# Altium schematic sheet Sheet3.SchDoc: =GlobalProjectName
size 209 x 297 mm; ApprovedBy: Утвердил; CheckedBy: Проверил; Author: Разработал; SheetNumber: 52; SheetTotal: 66; PageSetup: Record=PageOptions|CenterHorizontal=True|CenterVertical=True|PrintScale=1.00|XCorrection=1.00|YCorrection=1.00|PrintKind=1|BorderSize=5000000|LeftOffset=0|BottomOffset=0|Orientation=2|PaperLength=1000|PaperWidth=1000|Scale=100|PaperSource=15|PrintQuality=1200|MediaType=1|DitherType=10|PaperKind=A3|PrintScaleMode=1; Weight: -; ScaleFactor: -; NormInspection: Норм.Контр.
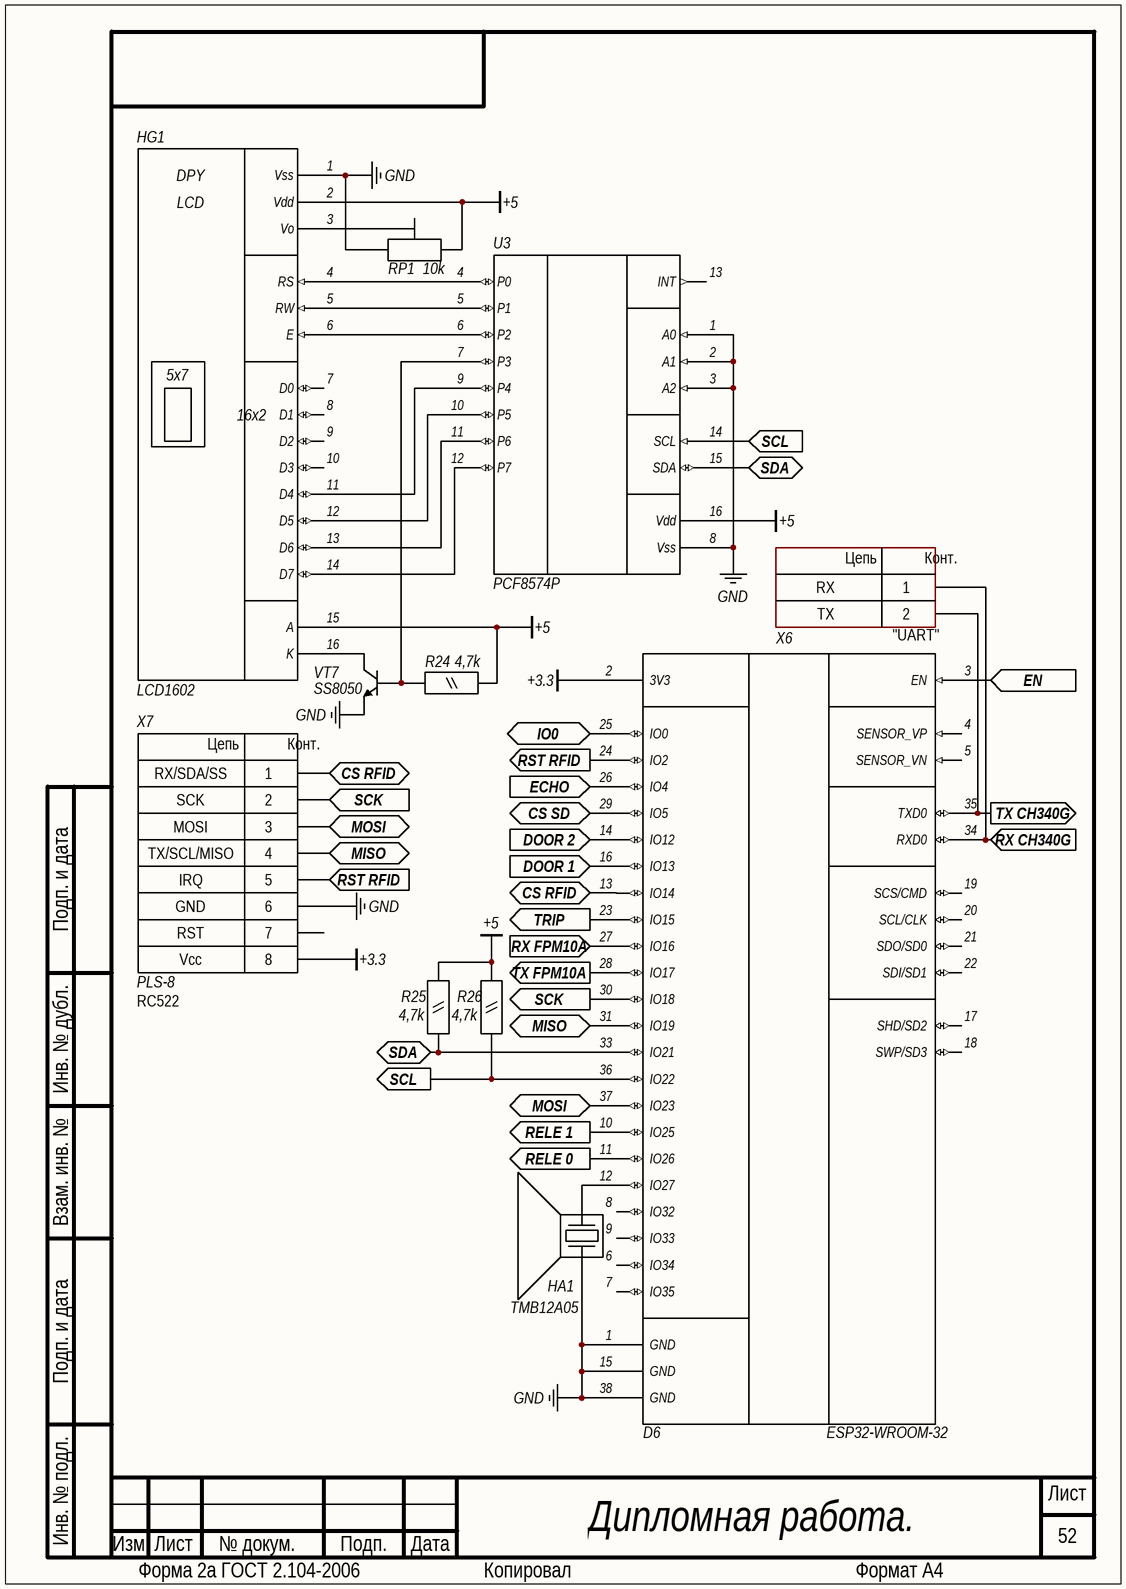
[diagram p0: Sheet3.SchDoc]

## Parts
D6  ESP32-WROOM-32  [D ESP-WROOOM-32]
HA1  TMB12A05  [HA TMB12A05]
HG1  LCD1602  [X PBS-16]
R24  4,7k  [R SMD 0805]
R25  4,7k  [R SMD 0805]
R26  4,7k  [R SMD 0805]
RP1  10k  [R ADJ-3296W]
U3  PCF8574P  [U DIP-16]
VT7  SS8050  [U SOT-23-3]
X6  CommentText: "UART"  Text1: RX  Text2: TX  [CON: PLS-2]
X7  PLS-8  CommentText: RC522  [X PLS-8]

## Ports
CS RFID (bidir), CS SD (bidir), DOOR 1 (in), DOOR 2 (in), ECHO (in), EN (in), IO0 (bidir), MISO (bidir), MOSI (bidir), RELE 0 (out), RELE 1 (out), RST RFID (in), RST RFID (out), RX CH340G (in), RX FPM10A (in), SCK (in), SCK (out), SCL (in), SCL (out), SDA (bidir), TRIP (out), TX CH340G (out), TX FPM10A (out)

## Nets
+3.3: D6.2(3V3) X7.8
+5: HG1.2(Vdd) HG1.15(A) R24.1 R25.1 R26.1 RP1.1 U3.16(Vdd)
GND: D6.1(GND) D6.15(GND) D6.38(GND) HA1.2(-) HG1.1(Vss) RP1.3 U3.1(A0) U3.2(A1) U3.3(A2) U3.8(Vss) VT7.1(E) X7.6
CS RFID: D6.13(IO14) X7.1 ; port CS RFID
CS SD: D6.29(IO5) ; port CS SD
DOOR 1: D6.16(IO13) ; port DOOR 1
DOOR 2: D6.14(IO12) ; port DOOR 2
ECHO: D6.26(IO4) ; port ECHO
EN: D6.3(EN) ; port EN
IO0: D6.25(IO0) ; port IO0
MISO: D6.31(IO19) X7.4 ; port MISO
MOSI: D6.37(IO23) X7.3 ; port MOSI
RELE 0: D6.11(IO26) ; port RELE 0
RELE 1: D6.10(IO25) ; port RELE 1
RST RFID: D6.24(IO2) X7.5 ; port RST RFID
RX CH340G: D6.34(RXD0) X6.1 ; port RX CH340G
RX FPM10A: D6.27(IO16) ; port RX FPM10A
SCK: D6.30(IO18) X7.2 ; port SCK
SCL: D6.36(IO22) R26.2 U3.14(SCL) ; port SCL
SDA: D6.33(IO21) R25.2 U3.15(SDA) ; port SDA
TRIP: D6.23(IO15) ; port TRIP
TX CH340G: D6.35(TXD0) X6.2 ; port TX CH340G
TX FPM10A: D6.28(IO17) ; port TX FPM10A
NetD6_12: D6.12(IO27) HA1.1(+)
NetHG1_3: HG1.3(Vo) RP1.2
NetHG1_4: HG1.4(RS) U3.4(P0)
NetHG1_5: HG1.5(RW) U3.5(P1)
NetHG1_6: HG1.6(E) U3.6(P2)
NetHG1_11: HG1.11(D4) U3.9(P4)
NetHG1_12: HG1.12(D5) U3.10(P5)
NetHG1_13: HG1.13(D6) U3.11(P6)
NetHG1_14: HG1.14(D7) U3.12(P7)
NetHG1_16: HG1.16(K) VT7.3(C)
NetR24_2: R24.2 U3.7(P3) VT7.2(B)

Not connected (* = marked no-connect by the designer): D6 4(SENSOR_VP) 5(SENSOR_VN) 6(IO34) 7(IO35) 8(IO32) 9(IO33) 17(SHD/SD2) 18(SWP/SD3) 19(SCS/CMD) 20(SCL/CLK) 21(SDO/SD0) 22(SDI/SD1); HG1 7(D0) 8(D1) 9(D2) 10(D3); U3 13(INT); X7 7

## Notes on the sheet
- Дипломная работа.
- Подп. и дата
- Инв. № дубл.
- Взам. инв. №
- Инв. № подл.
- Изм.
- Лист
- № докум.
- Подп.
- Дата
- Форма 2а ГОСТ 2.104-2006
- Копировал
- Формат А4
- (in symbol LCD HD44780) DPY
- (in symbol PLS-2) Цепь; Конт.
- (in symbol PLS/PBS-8) Цепь; Конт.

## Library data of the parts
D6 = ESP32-WROOM: Manufacturer: Espressif Systems; Model: ESP32-WROOM-32; ComponentLink1Description: Datasheet; ComponentLink1URL: https://www.espressif.com/sites/default/files/documentation/esp32-wroom-32_datasheet_en.pdf; ComponentLink2Description: Store; ComponentLink2URL: https://aliexpress.ru/item/32921866832.html?spm=a2g0s.9042311.0.0.264d33edwiJORy; ComponentLink3Description: HelpURL; ComponentLink3URL: *
HA1 = Пьездодинамик: Model: TMB12A05; Manufacturer: *; Diameter: *; Voltage: *; ComponentLink1Description: Datasheet; ComponentLink1URL: *; ComponentLink2Description: Store; ComponentLink2URL: *
HG1 = LCD HD44780: Дисплей на основе контроллера HD44780.; ScreenResolution: 16x2; CharacterResolution: 5x7; Model: LCD1602; Manufacturer: *; Type: LCD; ComponentLink1Description: Store; ComponentLink1URL: *; ComponentLink2Description: Datasheet; ComponentLink2URL: *; ComponentLink3Description: HelpURL; ComponentLink3URL: *
R24-R26 = Резистор 0.125 Вт: R; Model: RC0805FR-074K7L; Power: 0.125; Case: 0805; Manufacturer: *; ComponentLink1Description: Datasheet; ComponentLink1URL: *; ComponentLink2Description: HelpURL; ComponentLink2URL: *; Value: 4,7k; ComponentLink3Description: Store; ComponentLink3URL: https://www.chipdip.ru/product0/9000079502
RP1 = Подстроечный Резистор: Case: *; Manufacturer: *; Model: *; ComponentLink1Description: Datasheet; ComponentLink1URL: *; ComponentLink2Description: HelpURL; ComponentLink2URL: *; Value: 10k; Power: *; ComponentLink3Description: Store; ComponentLink3URL: *
U3 = PCF8574: IIC расширитель.; Model: PCF8574P; Manufacturer: *; Case: *; ComponentLink1Description: Datasheet №1; ComponentLink1URL: https://www.nxp.com/docs/en/data-sheet/PCF8574_PCF8574A.pdf; ComponentLink2Description: Datasheet №2; ComponentLink2URL: http://www.ti.com/lit/ds/symlink/pcf8574.pdf; ComponentLink3Description: HelpURL; ComponentLink3URL: *; ComponentLink4Description: Store; ComponentLink4URL: https://aliexpress.ru/item/4000480743714.html?spm=a2g0s.9042311.0.0.264d33edUHMLcH
VT7 = Биполярный Транзистор: Manufacturer: Hottech; Model: SS8050; Case: SOT-23-3; ComponentLink1Description: Datasheet; ComponentLink1URL: https://static.chipdip.ru/lib/210/DOC005210683.pdf; ComponentLink2Description: HelpURL; ComponentLink2URL: *; ComponentLink3Description: Store; ComponentLink3URL: https://www.chipdip.ru/product/ss8050-hottech
X6 = PLS-2: Manufacturer: Connfly; ValueManufacturerPartNumber: Connector, 2pin, 2.54mm, 500VAC, 3A; TypeConnector: Connector; VoltageMax: 500VAC; Pitch: 2.54mm; CurrentMax: 3A; Multichannel: 2pin; HelpURL: https://www.chipdip.ru/product/pls-2; PartNumber: PLS-2
X7 = PLS/PBS-8: TypeConnector: Connector; VoltageMax: 500VAC; Pitch: 2.54mm; CurrentMax: 3A; Multichannel: 8pin; Text8: Vcc; Text7: RST; Text6: GND; Text5: IRQ; Text4: TX/SCL/MISO; Text3: MOSI; Text2: SCK; Text1: RX/SDA/SS; Manufacturer: *; Model: PLS-8; ComponentLink1Description: Store; ComponentLink1URL: https://aliexpress.ru/item/33014153324.html?spm=a2g0s.9042311.0.0.264d33edMcVqDH